# EAGLE design Practicum_MC_protoboard (EAGLE 8.0.1)
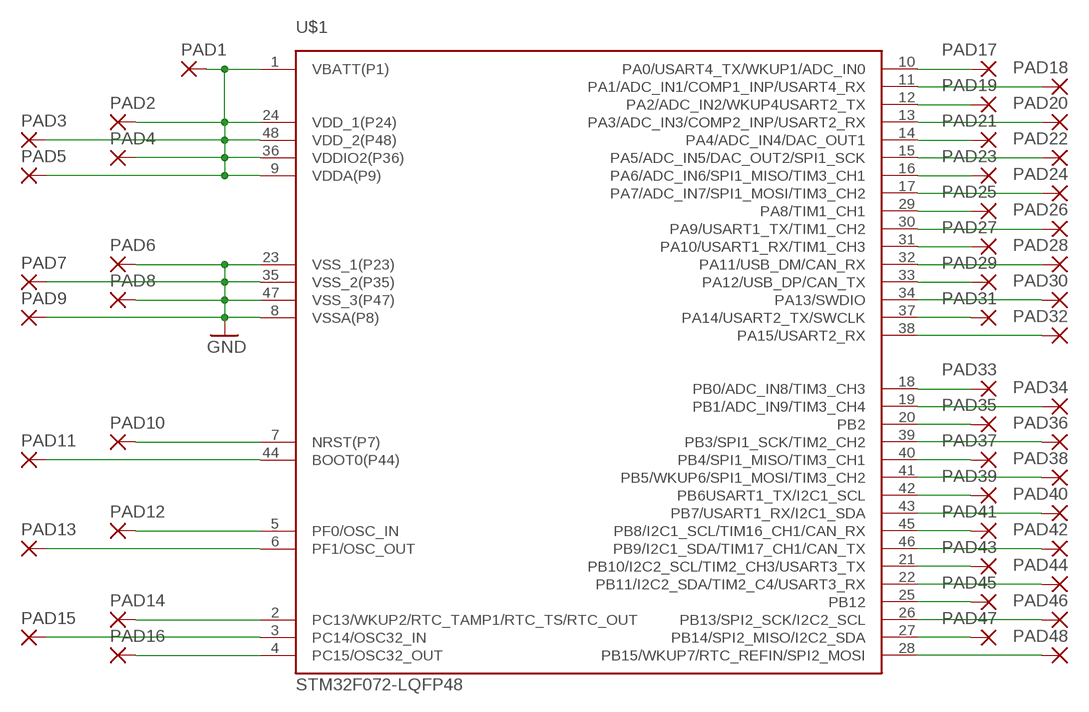
[diagram p0: schematic, sheet 1]

## Parts
PAD1  SMD5  [SMD2,54-5,08]
PAD2  SMD5  [SMD2,54-5,08]
PAD3  SMD5  [SMD2,54-5,08]
PAD4  SMD5  [SMD2,54-5,08]
PAD5  SMD5  [SMD2,54-5,08]
PAD6  SMD5  [SMD2,54-5,08]
PAD7  SMD5  [SMD2,54-5,08]
PAD8  SMD5  [SMD2,54-5,08]
PAD9  SMD5  [SMD2,54-5,08]
PAD10  SMD5  [SMD2,54-5,08]
PAD11  SMD5  [SMD2,54-5,08]
PAD12  SMD5  [SMD2,54-5,08]
PAD13  SMD5  [SMD2,54-5,08]
PAD14  SMD5  [SMD2,54-5,08]
PAD15  SMD5  [SMD2,54-5,08]
PAD16  SMD5  [SMD2,54-5,08]
PAD17  SMD5  [SMD2,54-5,08]
PAD18  SMD5  [SMD2,54-5,08]
PAD19  SMD5  [SMD2,54-5,08]
PAD20  SMD5  [SMD2,54-5,08]
PAD21  SMD5  [SMD2,54-5,08]
PAD22  SMD5  [SMD2,54-5,08]
PAD23  SMD5  [SMD2,54-5,08]
PAD24  SMD5  [SMD2,54-5,08]
PAD25  SMD5  [SMD2,54-5,08]
PAD26  SMD5  [SMD2,54-5,08]
PAD27  SMD5  [SMD2,54-5,08]
PAD28  SMD5  [SMD2,54-5,08]
PAD29  SMD5  [SMD2,54-5,08]
PAD30  SMD5  [SMD2,54-5,08]
PAD31  SMD5  [SMD2,54-5,08]
PAD32  SMD5  [SMD2,54-5,08]
PAD33  SMD5  [SMD2,54-5,08]
PAD34  SMD5  [SMD2,54-5,08]
PAD35  SMD5  [SMD2,54-5,08]
PAD36  SMD5  [SMD2,54-5,08]
PAD37  SMD5  [SMD2,54-5,08]
PAD38  SMD5  [SMD2,54-5,08]
PAD39  SMD5  [SMD2,54-5,08]
PAD40  SMD5  [SMD2,54-5,08]
PAD41  SMD5  [SMD2,54-5,08]
PAD42  SMD5  [SMD2,54-5,08]
PAD43  SMD5  [SMD2,54-5,08]
PAD44  SMD5  [SMD2,54-5,08]
PAD45  SMD5  [SMD2,54-5,08]
PAD46  SMD5  [SMD2,54-5,08]
PAD47  SMD5  [SMD2,54-5,08]
PAD48  SMD5  [SMD2,54-5,08]
U$1  STM32F072-LQFP48  [LQFP48]

## Nets
GND: PAD6.1(P) PAD7.1(P) PAD8.1(P) PAD9.1(P) U$1.8(VSSA(P8)) U$1.23(VSS_1(P23)) U$1.35(VSS_2(P35)) U$1.47(VSS_3(P47))
N$1: PAD33.1(P) U$1.18(PB0/ADC_IN8/TIM3_CH3)
N$2: PAD34.1(P) U$1.19(PB1/ADC_IN9/TIM3_CH4)
N$3: PAD35.1(P) U$1.20(PB2)
N$4: PAD36.1(P) U$1.39(PB3/SPI1_SCK/TIM2_CH2)
N$5: PAD37.1(P) U$1.40(PB4/SPI1_MISO/TIM3_CH1)
N$6: PAD38.1(P) U$1.41(PB5/WKUP6/SPI1_MOSI/TIM3_CH2)
N$7: PAD39.1(P) U$1.42(PB6USART1_TX/I2C1_SCL)
N$8: PAD40.1(P) U$1.43(PB7/USART1_RX/I2C1_SDA)
N$9: PAD41.1(P) U$1.45(PB8/I2C1_SCL/TIM16_CH1/CAN_RX)
N$10: PAD42.1(P) U$1.46(PB9/I2C1_SDA/TIM17_CH1/CAN_TX)
N$11: PAD43.1(P) U$1.21(PB10/I2C2_SCL/TIM2_CH3/USART3_TX)
N$12: PAD44.1(P) U$1.22(PB11/I2C2_SDA/TIM2_C4/USART3_RX)
N$13: PAD45.1(P) U$1.25(PB12)
N$14: PAD46.1(P) U$1.26(PB13/SPI2_SCK/I2C2_SCL)
N$15: PAD47.1(P) U$1.27(PB14/SPI2_MISO/I2C2_SDA)
N$16: PAD48.1(P) U$1.28(PB15/WKUP7/RTC_REFIN/SPI2_MOSI)
N$17: PAD32.1(P) U$1.38(PA15/USART2_RX)
N$18: PAD31.1(P) U$1.37(PA14/USART2_TX/SWCLK)
N$19: PAD30.1(P) U$1.34(PA13/SWDIO)
N$20: PAD29.1(P) U$1.33(PA12/USB_DP/CAN_TX)
N$21: PAD28.1(P) U$1.32(PA11/USB_DM/CAN_RX)
N$22: PAD27.1(P) U$1.31(PA10/USART1_RX/TIM1_CH3)
N$23: PAD26.1(P) U$1.30(PA9/USART1_TX/TIM1_CH2)
N$24: PAD25.1(P) U$1.29(PA8/TIM1_CH1)
N$25: PAD24.1(P) U$1.17(PA7/ADC_IN7/SPI1_MOSI/TIM3_CH2)
N$26: PAD23.1(P) U$1.16(PA6/ADC_IN6/SPI1_MISO/TIM3_CH1)
N$27: PAD22.1(P) U$1.15(PA5/ADC_IN5/DAC_OUT2/SPI1_SCK)
N$28: PAD21.1(P) U$1.14(PA4/ADC_IN4/DAC_OUT1)
N$29: PAD20.1(P) U$1.13(PA3/ADC_IN3/COMP2_INP/USART2_RX)
N$30: PAD19.1(P) U$1.12(PA2/ADC_IN2/WKUP4USART2_TX)
N$31: PAD18.1(P) U$1.11(PA1/ADC_IN1/COMP1_INP/USART4_RX)
N$32: PAD17.1(P) U$1.10(PA0/USART4_TX/WKUP1/ADC_IN0)
N$35: PAD1.1(P) PAD2.1(P) PAD3.1(P) PAD4.1(P) PAD5.1(P) U$1.1(VBATT(P1)) U$1.9(VDDA(P9)) U$1.24(VDD_1(P24)) U$1.36(VDDIO2(P36)) U$1.48(VDD_2(P48))
N$42: PAD10.1(P) U$1.7(NRST(P7))
N$43: PAD11.1(P) U$1.44(BOOT0(P44))
N$44: PAD12.1(P) U$1.5(PF0/OSC_IN)
N$45: PAD13.1(P) U$1.6(PF1/OSC_OUT)
N$46: PAD14.1(P) U$1.2(PC13/WKUP2/RTC_TAMP1/RTC_TS/RTC_OUT)
N$47: PAD15.1(P) U$1.3(PC14/OSC32_IN)
N$48: PAD16.1(P) U$1.4(PC15/OSC32_OUT)

## Library data of the parts
PAD1-PAD48 = wirepad:SMD5: SMD PAD
U$1 = stm32f0:STM32F072

## Net classes
0 default: width 0.254 mm

## Board
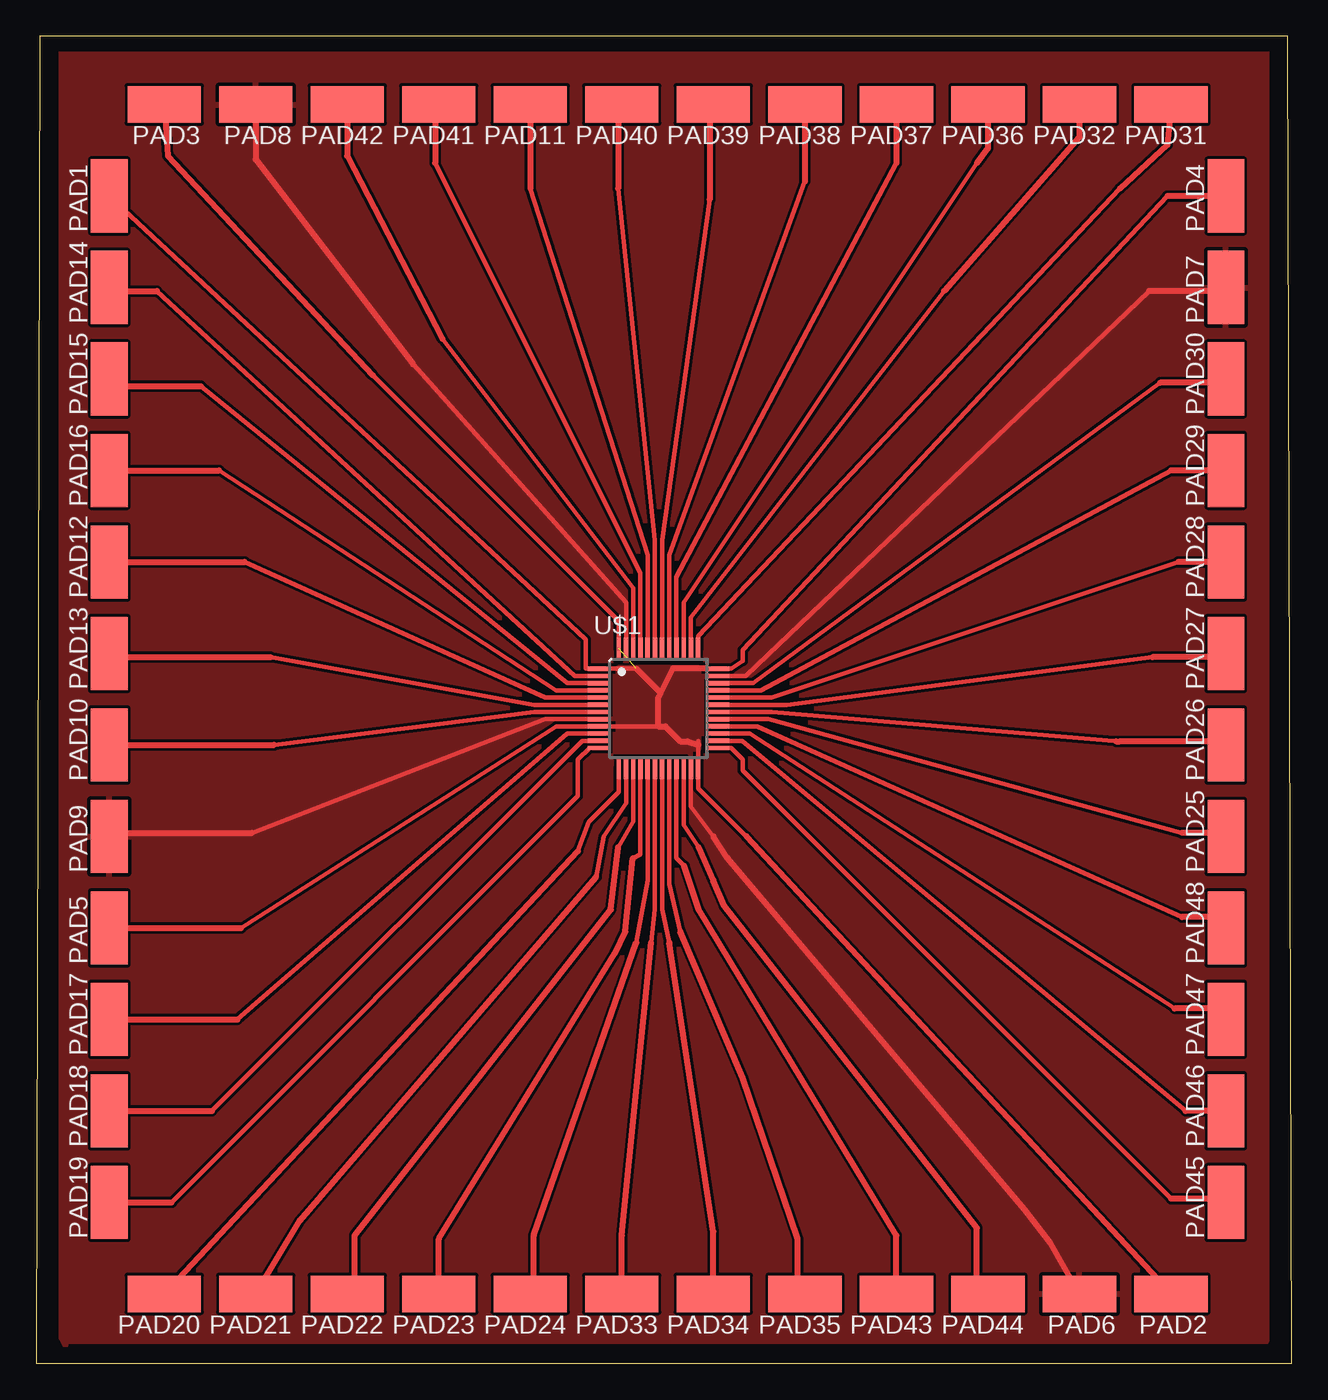
[diagram p1: board, top side]

Size 87.1 x 92.13 mm. Coordinates in mm from the lower left corner, seen from the top.
Outline: 0,0 87.1,0 86.85,92.13 0.25,92.13 0,0
Copper layers (1*16): Top 0.035mm / dielectric 1.5mm / Bottom 0.035mm
Design rules "default": minimum track width 10mil, minimum drill 24mil, track to track 8mil, track to pad 8mil, pad to pad 8mil, via to via 8mil, smd to smd 8mil, copper to edge 40mil, drill to drill 8mil, minimum pad ring 10mil, minimum via ring 8mil, stop-mask expansion 4mil, vias tented up to drill 0mil, thermal gap 10mil

### Footprints (pad centres in the part's own frame; a part is rotated, then mirrored left to right if it is on the bottom)
SMD2,54-5,08 = smd 2.54 x 5.08: 1 0,0
LQFP48 = smd 1.5 x 0.3: 1 -4.15,2.75; 2 -4.15,2.25; 3 -4.15,1.75; 4 -4.15,1.25; 5 -4.15,0.75; 6 -4.15,0.25; 7 -4.15,-0.25; 8 -4.15,-0.75; 9 -4.15,-1.25; 10 -4.15,-1.75; 11 -4.15,-2.25; 12 -4.15,-2.75; 25 4.15,-2.75; 26 4.15,-2.25; 27 4.15,-1.75; 28 4.15,-1.25; 29 4.15,-0.75; 30 4.15,-0.25; 31 4.15,0.25; 32 4.15,0.75; 33 4.15,1.25; 34 4.15,1.75; 35 4.15,2.25; 36 4.15,2.75 | smd 0.3 x 1.5: 13 -2.75,-4.15; 14 -2.25,-4.15; 15 -1.75,-4.15; 16 -1.25,-4.15; 17 -0.75,-4.15; 18 -0.25,-4.15; 19 0.25,-4.15; 20 0.75,-4.15; 21 1.25,-4.15; 22 1.75,-4.15; 23 2.25,-4.15; 24 2.75,-4.15; 37 2.75,4.15; 38 2.25,4.15; 39 1.75,4.15; 40 1.25,4.15; 41 0.75,4.15; 42 0.25,4.15; 43 -0.25,4.15; 44 -0.75,4.15; 45 -1.25,4.15; 46 -1.75,4.15; 47 -2.25,4.15; 48 -2.75,4.15

### Placement (x,y rotation side)
PAD1  5.08,81.03 0 top
PAD2  78.74,4.83 90 top
PAD3  8.89,87.38 90 top
PAD4  82.55,81.03 0 top
PAD5  5.08,30.23 0 top
PAD6  72.39,4.83 90 top
PAD7  82.55,74.68 0 top
PAD8  15.24,87.38 90 top
PAD9  5.08,36.58 0 top
PAD10  5.08,42.93 0 top
PAD11  34.29,87.38 90 top
PAD12  5.08,55.63 0 top
PAD13  5.08,49.28 0 top
PAD14  5.08,74.68 0 top
PAD15  5.08,68.33 0 top
PAD16  5.08,61.98 0 top
PAD17  5.08,23.88 0 top
PAD18  5.08,17.53 0 top
PAD19  5.08,11.18 0 top
PAD20  8.89,4.83 90 top
PAD21  15.24,4.83 90 top
PAD22  21.59,4.83 90 top
PAD23  27.94,4.83 90 top
PAD24  34.29,4.83 90 top
PAD25  82.55,36.58 0 top
PAD26  82.55,42.93 0 top
PAD27  82.55,49.28 0 top
PAD28  82.55,55.63 0 top
PAD29  82.55,61.98 0 top
PAD30  82.55,68.33 0 top
PAD31  78.74,87.38 90 top
PAD32  72.39,87.38 90 top
PAD33  40.64,4.83 90 top
PAD34  46.99,4.83 90 top
PAD35  53.34,4.83 90 top
PAD36  66.04,87.38 90 top
PAD37  59.69,87.38 90 top
PAD38  53.34,87.38 90 top
PAD39  46.99,87.38 90 top
PAD40  40.64,87.38 90 top
PAD41  27.94,87.38 90 top
PAD42  21.59,87.38 90 top
PAD43  59.69,4.83 90 top
PAD44  66.04,4.83 90 top
PAD45  82.55,11.18 0 top
PAD46  82.55,17.53 0 top
PAD47  82.55,23.88 0 top
PAD48  82.55,30.23 0 top
U$1  43.18,45.47 0 top

### Tracks (layer width: path | path; a pad name or v marks a point on that pad's centre or on a via)
GND
  Top 0.305: 46.99,36.58 45.43,38.64 U$1.23 | 77.22,74.42 49.24,47.72 U$1.35 | 26.16,69.34 40.93,52.8 U$1.47 | 14.99,36.83 35.32,44.72 U$1.8
  Top 0.406: PAD6.1 70.36,8.38 68.58,10.67 47.97,35.09 46.99,36.58 | PAD7.1 82.3,74.42 77.22,74.42 | PAD8.1 15.24,83.57 26.16,69.34 | PAD9.1 5.33,36.83 14.99,36.83
  pour Top: 1.78,91.19 85.34,91.19 85.34,1.52 2.03,1.52 2.03,1.27 1.78,1.78
N$1
  Top 0.254: 42.67,29.21 42.68,29.21
  Top 0.305: 42.68,29.21 42.67,29.22 42.93,31.5 U$1.18
  Top 0.406: PAD33.1 40.64,8.89 42.67,29.21
N$2
  Top 0.305: 43.94,29.21 43.94,29.22 43.43,31.5 U$1.19
  Top 0.406: PAD34.1 46.99,9.14 43.94,29.21
N$3
  Top 0.305: 44.7,29.97 43.93,33.29 U$1.20
  Top 0.406: PAD35.1 52.83,5.33 52.83,8.64 49.02,19.81 44.7,29.97
N$4
  Top 0.305: 65.28,83.31 44.93,52.8 U$1.39
  Top 0.406: PAD36.1 66.04,84.33 65.28,83.31
N$5
  Top 0.305: 59.69,83.31 44.43,54.59 U$1.40
  Top 0.406: PAD37.1 59.69,83.31
N$6
  Top 0.305: 53.34,82.04 43.93,56.12 U$1.41
  Top 0.406: PAD38.1 53.34,82.04
N$7
  Top 0.305: 46.74,80.77 43.43,57.15 U$1.42
  Top 0.406: PAD39.1 46.74,87.12 46.74,80.77
N$8
  Top 0.305: 40.39,81.53 42.93,57.15 U$1.43
  Top 0.406: PAD40.1 40.39,87.12 40.39,81.53
N$9
  Top 0.305: 27.69,83.31 41.93,54.84 U$1.45
  Top 0.406: PAD41.1 27.69,86.36 27.69,83.31
N$10
  Top 0.305: 28.19,71.12 41.43,53.82 U$1.46
  Top 0.406: PAD42.1 21.59,83.82 28.19,71.12
N$11
  Top 0.305: 44.96,34.54 44.43,35.07 U$1.21
  Top 0.406: PAD43.1 59.69,8.89 45.97,31.5 44.96,34.54
N$12
  Top 0.305: 45.97,35.81 44.93,37.37 U$1.22
  Top 0.406: PAD44.1 65.28,5.59 65.28,9.4 47.75,31.75 46.99,33.53 45.97,35.81
N$13
  Top 0.305: U$1.25 48.22,42.72 49.02,41.91 49.02,41.15 78.74,11.43
  Top 0.406: PAD45.1 82.3,11.43 78.74,11.43
N$14
  Top 0.305: 79.76,17.53 48.99,43.22 U$1.26
  Top 0.406: PAD46.1 79.76,17.53
N$15
  Top 0.305: 78.99,24.64 49.5,43.72 U$1.27
  Top 0.406: PAD47.1 81.79,24.64 78.99,24.64
N$16
  Top 0.305: 79.5,30.99 50.02,44.22 U$1.28
  Top 0.406: PAD48.1 81.79,30.99 79.5,30.99
N$17
  Top 0.305: 62.99,74.42 45.43,51.78 U$1.38
  Top 0.406: PAD32.1 72.39,85.09 62.99,74.42
N$18
  Top 0.305: 75.18,81.53 45.93,50.5 U$1.37
  Top 0.406: PAD31.1 78.49,84.58 75.18,81.53
N$19
  Top 0.305: 77.98,68.07 49.76,47.22 U$1.34
  Top 0.406: PAD30.1 82.3,68.07 77.98,68.07
N$20
  Top 0.305: 78.74,61.98 50.27,46.72 U$1.33
  Top 0.406: PAD29.1 78.74,61.98
N$21
  Top 0.305: 79.25,55.63 51.04,46.22 U$1.32
  Top 0.406: PAD28.1 79.25,55.63
N$22
  Top 0.305: 77.47,49.02 52.07,45.72 U$1.31
  Top 0.406: PAD27.1 82.3,49.02 77.47,49.02
N$23
  Top 0.305: 75.18,43.18 51.06,45.22 U$1.30
  Top 0.406: PAD26.1 82.3,43.18 75.18,43.18 74.93,43.18
N$24
  Top 0.305: 79.5,36.83 50.79,44.72 U$1.29
  Top 0.406: PAD25.1 82.3,36.83 79.5,36.83
N$25
  Top 0.305: 41.66,29.21 42.43,33.54 U$1.17
  Top 0.406: PAD24.1 34.54,5.08 34.54,8.89 41.66,29.21
N$26
  Top 0.305: 41.4,35.05 41.93,35.33 U$1.16
  Top 0.406: PAD23.1 27.94,8.64 40.13,28.45 40.89,29.97 41.4,35.05
N$27
  Top 0.305: 40.39,35.81 41.43,37.62 U$1.15
  Top 0.406: PAD22.1 22.1,5.33 22.1,8.89 39.88,31.5 40.39,35.81
N$28
  Top 0.305: 38.86,33.78 39.37,36.58 40.93,38.9 U$1.14
  Top 0.406: PAD21.1 18.29,9.91 19.81,11.68 38.86,33.78
N$29
  Top 0.305: 37.59,35.56 38.35,37.59 40.43,39.67 U$1.13
  Top 0.406: PAD20.1 37.59,35.56
N$30
  Top 0.305: 9.4,11.18 37.59,39.37 37.59,41.91 38.4,42.72 U$1.12
  Top 0.406: PAD19.1 9.4,11.18
N$31
  Top 0.305: 12.19,17.53 37.88,43.22 U$1.11
  Top 0.406: PAD18.1 12.19,17.53
N$32
  Top 0.305: 13.97,23.88 36.86,43.72 U$1.10
  Top 0.406: PAD17.1 13.97,23.88
N$35  (1 unrouted)
  Top 0.305: 49.28,36.58 45.93,39.92 U$1.24 45.95,43.19 45.97,42.93 | 23.37,68.58 40.43,51.52 U$1.48 | 78.49,81.03 49.02,49.53 49.02,48.77 48.22,48.22 U$1.36 46.36,48.26 | 14.22,30.23 36.09,44.22 U$1.9 43.18,44.22 | PAD1.1 38.1,50.29 38.14,50.25 38.14,48.22 U$1.1 41.65,48.22
  Top 0.406: PAD2.1 49.28,36.58 | PAD3.1 9.14,83.82 23.37,68.58 | PAD4.1 78.49,81.03 | PAD5.1 14.22,30.23 | 45.97,42.93 45.21,43.18 44.7,43.18 43.67,44.22 43.18,44.22 43.18,46.23 43.33,46.53 | 43.33,46.53 44.2,48.26 46.36,48.26 | 41.65,48.22 43.33,46.53
  pour Top: 40.39,48.26 40.39,42.67 45.97,42.67 45.97,48.26
N$42
  Top 0.305: 16.51,42.93 34.55,45.22 U$1.7
  Top 0.406: PAD10.1 16.51,42.93
N$43
  Top 0.305: 34.29,81.53 42.43,56.12 U$1.44
  Top 0.406: PAD11.1 34.29,81.53
N$44
  Top 0.305: 14.48,55.63 35.32,46.22 U$1.5
  Top 0.406: PAD12.1 14.48,55.63
N$45
  Top 0.305: 16.26,49.02 34.55,45.72 U$1.6
  Top 0.406: PAD13.1 5.33,49.02 16.26,49.02
N$46
  Top 0.305: 8.38,74.42 37.37,47.72 U$1.2
  Top 0.406: PAD14.1 5.33,74.42 8.38,74.42
N$47
  Top 0.305: 11.43,67.82 36.86,47.22 U$1.3
  Top 0.406: PAD15.1 5.59,67.82 11.43,67.82
N$48
  Top 0.305: 12.7,61.98 36.09,46.72 U$1.4
  Top 0.406: PAD16.1 12.7,61.98